# EasyEDA Pro project powerbank.epro

# Schematic Schematic1
Board Name: Board1; Create Date: 2026-05-27; Page Name: P1; Project Name: PowerbankForConsole7; Schematic Name: Schematic1; Update Date: 2026-05-28; Company: EasyEDA.com; Page Size: A4; Version: V1.0
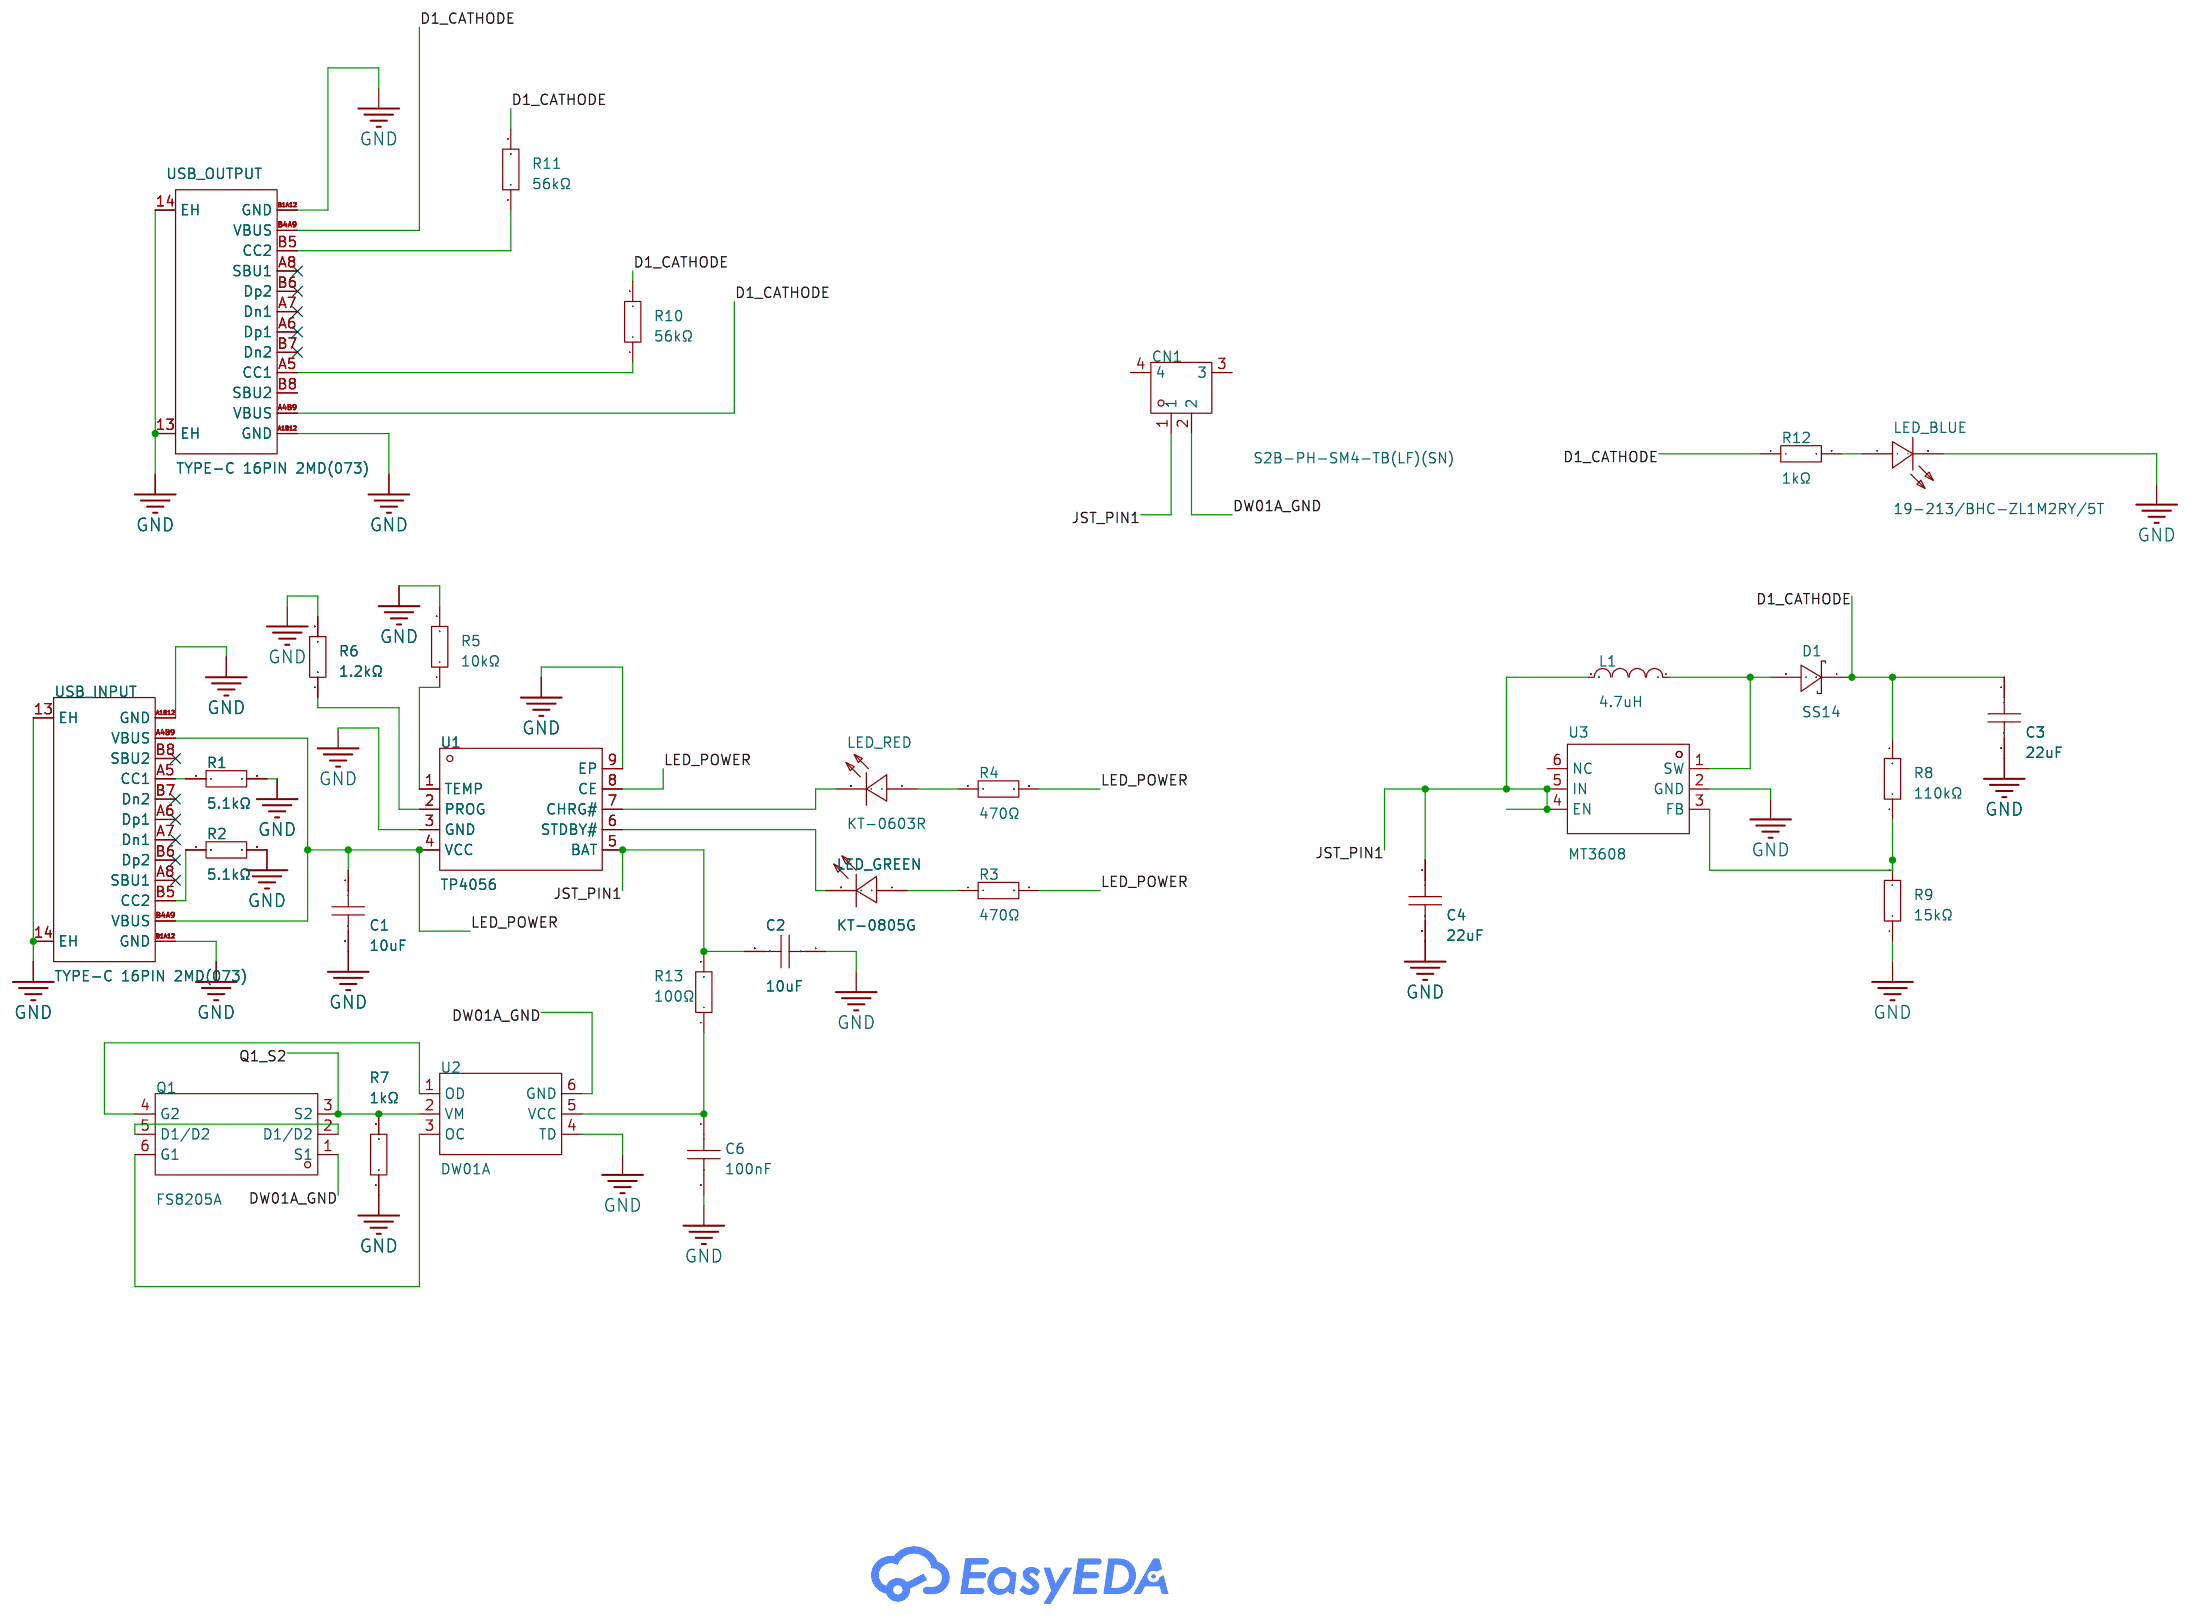
[diagram p0: schematic sheet]

## Parts
C1  10uF  [C0201]
C2  10uF  [C0201]
C3  22uF  [C0201]
C4  22uF  [C0201]
C6  100nF  [C0201]
CN1  S2B-PH-SM4-TB(LF)(SN)  [CONN-SMD_P2.00_S2B-PH-SM4-TB-LF-SN]
D1  SS14  [SMA_L4.2-W2.6-LS5.3-RD]
L1  4.7uH  [IND-SMD_L4.4-W4.2]
LED_BLUE  19-213/BHC-ZL1M2RY/5T  [LED0603-R-RD_BLUE]
LED_GREEN  KT-0805G  [LED0805-R-RD]
LED_RED  KT-0603R  [LED-SMD_L1.6-W0.8-R-RD]
Q1  FS8205A  [SOT-23-6_L2.9-W1.6-P0.95-LS2.8-BR]
R1  5.1kΩ  [R0603]
R2  5.1kΩ  [R0603]
R3  470Ω  [R0603]
R4  470Ω  [R0603]
R5  10kΩ  [R0603]
R6  1.2kΩ  [R0603]
R7  1kΩ  [R0603]
R8  110kΩ  [R0603]
R9  15kΩ  [R0603]
R10  56kΩ  [R0603]
R11  56kΩ  [R0603]
R12  1kΩ  [R0603]
R13  100Ω  [R0603]
U1  TP4056  [ESOP-8_L4.9-W3.9-P1.27-LS6.0-BL-EP]
U2  DW01A  [SOT-23-6_L2.9-W1.6-P0.95-LS2.8-BL]
U3  MT3608  [SOT-23-6_L2.9-W1.6-P0.95-LS2.8-BL]
USB_INPUT  TYPE-C 16PIN 2MD(073)  [USB-C-SMD_TYPE-C-16PIN-2MD-073]
USB_OUTPUT  TYPE-C 16PIN 2MD(073)  [USB-C-SMD_TYPE-C-16PIN-2MD-073]

## Library data of the parts
C1 C2 = CL10A106KP8NNNC: Capacitance:10uF Tolerance:±10% Tolerance:±10% Voltage Rating:10V Temperature Coefficient:X5R; LCSC Part Name: 10uF ±10% 10V; Supplier Part: C19702; Manufacturer: SAMSUNG(三星); Supplier Footprint: 0603; JLCPCB Part Class: Basic Part; Datasheet: https://item.szlcsc.com/datasheet/CL10A106KP8NNNC/20411.html; Supplier: LCSC; Tolerance: ±10%; Voltage Rating: 10V; Temperature Coefficient: X5R
C3 C4 = CL10A226MP8NUNE: Capacitance:22uF Tolerance:±20% Tolerance:±20% Voltage Rating:10V Temperature Coefficient:X5R; LCSC Part Name: 22uF ±20% 10V; Supplier Part: C86295; Manufacturer: SAMSUNG(三星); Supplier Footprint: 0603; JLCPCB Part Class: Extended Part; Datasheet: https://item.szlcsc.com/datasheet/CL10A226MP8NUNE/87471.html; Supplier: LCSC; Tolerance: ±20%; Voltage Rating: 10V; Temperature Coefficient: X5R
C6 = CL03A104KQ3NNNC: Capacitance:100nF Tolerance:±10% Tolerance:±10% Voltage Rating:6.3V Temperature Coefficient:X5R; LCSC Part Name: 100nF ±10% 6.3V; Supplier Part: C160831; Manufacturer: SAMSUNG(三星); Supplier Footprint: 0201; JLCPCB Part Class: Extended Part; Datasheet: https://item.szlcsc.com/datasheet/CL03A104KQ3NNNC/172212.html; Supplier: LCSC; Tolerance: ±10%; Voltage Rating: 6.3V; Temperature Coefficient: X5R
CN1 = S2B-PH-SM4-TB(LF)(SN): Pins Structure:1x2P Pitch:2mm Mounting Style:Horizontal attachment Reference Series:PH Number of Pins:2P Number of Rows:1 Number of PINs Per Row:2 Row Spacing:- Current Rating (Max):2A Contact Material:Copper alloy Contact Plating:Tin Operating Temperatur; LCSC Part Name: 1x2P 间距:2mm 卧贴 系列:PH; Supplier Part: C295747; Manufacturer: JST; Supplier Footprint: SMD,P=2mm,卧贴; JLCPCB Part Class: Extended Part; Datasheet: https://atta.szlcsc.com/upload/public/pdf/source/20210203/C295747_344B2E64535E381E727D98C302AB61C7.pdf; Supplier: LCSC; Pins Structure: 1x2P; Pitch: 2mm; Mounting Style: Horizontal attachment; Reference Series: PH; Number of Pins: 2P; Number of Rows: 1; Number of PINs Per Row: 2; Current Rating (Max): 2A; Contact Material: Copper alloy; Contact Plating: Tin; Operating Temperature Range: -25℃~+85℃; Rated Voltage (Max): 100V; Plastic Material: PA; Flame Retardant Rating: UL94V-0; Supplementary Features: Auxiliary soldering legs; Colour: Beige; Z-Height of the Board: 5.5mm; X-Length of Bottom Edge on Board (Spacing Line): 7.9mm; Y-Width of Bottom Edge on Board: 8.6mm
D1 = SS14_C7450452: Diode Configuration:Independent Voltage - Forward(Vf@If):550mV@1A Voltage - DC Reverse(Vr):40V Current - Rectified:1A Reverse Leakage Current (Ir):100uA@40V Operating Junction Temperature Range:-55℃~+150℃ Operating Junction Temperature Range:-55℃~+150℃ No; LCSC Part Name: 电压:40V 电流:1A; Supplier Part: C7450452; Manufacturer: LJ(朗捷); Supplier Footprint: DO-214AC(SMA); JLCPCB Part Class: Extended Part; Datasheet: https://item.szlcsc.com/datasheet/SS14/8475144.html; Supplier: LCSC; Diode Configuration: Independent; Voltage - Forward(Vf@If): 550mV@1A; Voltage - DC Reverse(Vr): 40V; Current - Rectified: 1A; Reverse Leakage Current (Ir): 100uA@40V; Operating Junction Temperature Range: -55℃~+150℃; Non-Repetitive Peak Forward Surge Current: 30A
L1 = FXL0420-4R7-M: Inductance:4.7uH Tolerance:±20% Tolerance:±20% Current Rating:2.8A Current - Saturation(Isat):3A DC Resistance(DCR):105mΩ Type:Molded Inductor; LCSC Part Name: 4.7uH ±20% 3A; Supplier Part: C167208; Manufacturer: cjiang(长江微电); Supplier Footprint: SMD,4.4x4.2mm; JLCPCB Part Class: Extended Part; Datasheet: https://item.szlcsc.com/datasheet/FXL0420-4R7-M/178591.html; Supplier: LCSC; Tolerance: ±20%; Current Rating: 2.8A; Current - Saturation(Isat): 3A; DC Resistance(DCR): 105mΩ; Type: Molded Inductor
LED_BLUE = 19-213/BHC-ZL1M2RY/5T: Lamp Holder Type:- Illumination Color:Blue Voltage - Forward(Vf):2.5V~3.1V Voltage - Forward(Vf):2.5V~3.1V Power(Watts):- Forward Current:- Wavelength - Dominant:465nm~475nm Wavelength - Dominant:465nm~475nm Peak Wavelength:468nm Diode Configuration:- Len; LCSC Part Name: 蓝色; Supplier Part: C2987539; Manufacturer: EVERLIGHT(亿光); Supplier Footprint: 0603; JLCPCB Part Class: Extended Part; Supplier: LCSC; Illumination Color: Blue; Voltage - Forward(Vf): 2.5V~3.1V; Wavelength - Dominant: 465nm~475nm; Peak Wavelength: 468nm; Lens Color: Water Clear; Luminous Intensity: 11.5mcd~28.5mcd; Viewing Angle: 120°; Operating Temperature: -40℃~+85℃
LED_GREEN = KT-0805G: Lamp Holder Type:2mm x 1.25mm square LED Illumination Color:Emerald Green Voltage - Forward(Vf):2.6V~3.1V Voltage - Forward(Vf):2.6V~3.1V Power(Watts):100mW Forward Current:5mA Wavelength - Dominant:513nm~528nm Wavelength - Dominant:513nm~528nm Peak Wavel; LCSC Part Name: 0805 翠绿 高亮; Supplier Part: C2297; Manufacturer: KENTO; Supplier Footprint: 0805; JLCPCB Part Class: Basic Part; Datasheet: https://item.szlcsc.com/datasheet/KT-0805G/2670.html; Supplier: LCSC; Lamp Holder Type: 2mm x 1.25mm square LED; Illumination Color: Emerald Green; Voltage - Forward(Vf): 2.6V~3.1V; Power(Watts): 100mW; Forward Current: 5mA; Wavelength - Dominant: 513nm~528nm; Peak Wavelength: 525nm; Diode Configuration: Discrete Diode; Lens Color: Water Clear; Luminous Intensity: 430mcd; Viewing Angle: 120°; Operating Temperature: -40℃~+85℃
LED_RED = KT-0603R: Lamp Holder Type:1.6mm x 0.8mm square LED Illumination Color:Red Voltage - Forward(Vf):1.8V~2.4V Voltage - Forward(Vf):1.8V~2.4V Power(Watts):40mW Forward Current:20mA Wavelength - Dominant:615nm~630nm Wavelength - Dominant:615nm~630nm Peak Wavelength:645; LCSC Part Name: 0603 红灯 高亮; Supplier Part: C2286; Manufacturer: KENTO; Supplier Footprint: 0603; JLCPCB Part Class: Basic Part; Datasheet: https://item.szlcsc.com/datasheet/KT-0603R/2659.html; Supplier: LCSC; Lamp Holder Type: 1.6mm x 0.8mm square LED; Illumination Color: Red; Voltage - Forward(Vf): 1.8V~2.4V; Power(Watts): 40mW; Forward Current: 20mA; Wavelength - Dominant: 615nm~630nm; Peak Wavelength: 645nm; Diode Configuration: Discrete Diode; Lens Color: Water Clear; Luminous Intensity: 300mcd; Viewing Angle: 120°; Operating Temperature: -40℃~+85℃
Q1 = FS8205A_C2830320: Type:2 N-Channel Drain Source Voltage (Vdss): Continuous Drain Current (Id): Drain Source On Resistance (RDS(on)@Vgs,Id):25mΩ@2.5V,3A Power Dissipation (Pd): Gate Threshold Voltage (Vgs(th)@Id):500mV@250uA Total Gate Charge (Qg@Vgs):5.7nC@10V Input Capaci; LCSC Part Name: 2个N沟道 耐压:20V 电流:6A; Supplier Part: C2830320; Manufacturer: TECH PUBLIC(台舟); Supplier Footprint: SOT-23-6; JLCPCB Part Class: Extended Part; Datasheet: https://atta.szlcsc.com/upload/public/pdf/source/20210810/F53B6D4E8755A1F8E11BAF814CE98E6A.pdf; Supplier: LCSC; Type: 2 N-Channel; Drain Source On Resistance (RDS(on)@Vgs,Id): 25mΩ@2.5V,3A; Gate Threshold Voltage (Vgs(th)@Id): 500mV@250uA; Total Gate Charge (Qg@Vgs): 5.7nC@10V; Input Capacitance (Ciss@Vds): 466pF@10V; Reverse Transfer Capacitance (Crss@Vds): 58pF@10V; Operating Temperature: -55℃~+150℃
R1 R2 = 0603WAF5101T5E: Type:Thick Film Resistor Resistance:5.1kΩ Tolerance:±1% Tolerance:±1% Power(Watts):100mW Voltage-Supply(Max):75V Temperature Coefficient:±100ppm/℃ Temperature Coefficient:±100ppm/℃ Operating Temperature:-55℃~+155℃ Operating Temperature:-55℃~+155℃; LCSC Part Name: 5.1kΩ ±1% 100mW 厚膜电阻; Supplier Part: C23186; Manufacturer: UNI-ROYAL(厚声); Supplier Footprint: 0603; JLCPCB Part Class: Basic Part; Datasheet: https://item.szlcsc.com/datasheet/0603WAF5101T5E/23913.html; Supplier: LCSC; Type: Thick Film Resistor; Tolerance: ±1%; Power(Watts): 100mW; Voltage-Supply(Max): 75V; Temperature Coefficient: ±100ppm/℃; Operating Temperature: -55℃~+155℃
R3 R4 = 0603WAF4700T5E: Type:Thick Film Resistor Resistance:470Ω Tolerance:±1% Tolerance:±1% Power(Watts):100mW Voltage-Supply(Max):75V Temperature Coefficient:±100ppm/℃ Temperature Coefficient:±100ppm/℃ Operating Temperature:-55℃~+155℃ Operating Temperature:-55℃~+155℃; LCSC Part Name: 470Ω ±1% 100mW 厚膜电阻; Supplier Part: C23179; Manufacturer: UNI-ROYAL(厚声); Supplier Footprint: 0603; JLCPCB Part Class: Basic Part; Datasheet: https://item.szlcsc.com/datasheet/0603WAF4700T5E/23906.html; Supplier: LCSC; Type: Thick Film Resistor; Tolerance: ±1%; Power(Watts): 100mW; Voltage-Supply(Max): 75V; Temperature Coefficient: ±100ppm/℃; Operating Temperature: -55℃~+155℃
R5 = 0603WAF1002T5E: Type:Thick Film Resistor Resistance:10kΩ Tolerance:±1% Tolerance:±1% Power(Watts):100mW Voltage-Supply(Max):75V Temperature Coefficient:±100ppm/℃ Temperature Coefficient:±100ppm/℃ Operating Temperature:-55℃~+155℃ Operating Temperature:-55℃~+155℃; LCSC Part Name: 厚膜电阻 10kΩ ±1% 100mW; Supplier Part: C25804; Manufacturer: UNI-ROYAL(厚声); Supplier Footprint: 0603; JLCPCB Part Class: Basic Part; Datasheet: https://item.szlcsc.com/datasheet/0603WAF1002T5E/26547.html; Supplier: LCSC; Type: Thick Film Resistor; Tolerance: ±1%; Power(Watts): 100mW; Voltage-Supply(Max): 75V; Temperature Coefficient: ±100ppm/℃; Operating Temperature: -55℃~+155℃
R6 = RC0603FR-071K2L: Type:Thick Film Resistor Resistance:1.2kΩ Tolerance:±1% Tolerance:±1% Power(Watts):100mW Voltage-Supply(Max):75V Temperature Coefficient:±100ppm/℃ Temperature Coefficient:±100ppm/℃ Operating Temperature:-55℃~+155℃ Operating Temperature:-55℃~+155℃; LCSC Part Name: 厚膜电阻 1.2kΩ ±1% 100mW; Supplier Part: C114605; Manufacturer: YAGEO(国巨); Supplier Footprint: 0603; JLCPCB Part Class: Extended Part; Datasheet: https://item.szlcsc.com/datasheet/RC0603FR-071K2L/115849.html; Supplier: LCSC; Type: Thick Film Resistor; Tolerance: ±1%; Power(Watts): 100mW; Voltage-Supply(Max): 75V; Temperature Coefficient: ±100ppm/℃; Operating Temperature: -55℃~+155℃
R7 R12 = RC0603FR-071KL: Type:Thick Film Resistor Resistance:1kΩ Tolerance:±1% Tolerance:±1% Power(Watts):100mW Voltage-Supply(Max):75V Temperature Coefficient:±100ppm/℃ Temperature Coefficient:±100ppm/℃ Operating Temperature:-55℃~+155℃ Operating Temperature:-55℃~+155℃; LCSC Part Name: 厚膜电阻 1kΩ ±1% 100mW; Supplier Part: C22548; Manufacturer: YAGEO(国巨); Supplier Footprint: 0603; JLCPCB Part Class: Extended Part; Datasheet: https://item.szlcsc.com/datasheet/RC0603FR-071KL/23274.html; Supplier: LCSC; Type: Thick Film Resistor; Tolerance: ±1%; Power(Watts): 100mW; Voltage-Supply(Max): 75V; Temperature Coefficient: ±100ppm/℃; Operating Temperature: -55℃~+155℃
R8 = 0603WAF1103T5E: Type:Thick Film Resistor Resistance:110kΩ Tolerance:±1% Tolerance:±1% Power(Watts):100mW Voltage-Supply(Max):75V Temperature Coefficient:±100ppm/℃ Temperature Coefficient:±100ppm/℃ Operating Temperature:-55℃~+155℃ Operating Temperature:-55℃~+155℃; LCSC Part Name: 110kΩ ±1% 100mW 厚膜电阻; Supplier Part: C25805; Manufacturer: UNI-ROYAL(厚声); Supplier Footprint: 0603; JLCPCB Part Class: Extended Part; Datasheet: https://item.szlcsc.com/datasheet/0603WAF1103T5E/26548.html; Supplier: LCSC; Type: Thick Film Resistor; Tolerance: ±1%; Power(Watts): 100mW; Voltage-Supply(Max): 75V; Temperature Coefficient: ±100ppm/℃; Operating Temperature: -55℃~+155℃
R9 = RC0603FR-0715KL: Type:Thick Film Resistor Resistance:15kΩ Tolerance:±1% Tolerance:±1% Power(Watts):100mW Voltage-Supply(Max):75V Temperature Coefficient:±100ppm/℃ Temperature Coefficient:±100ppm/℃ Operating Temperature:-55℃~+155℃ Operating Temperature:-55℃~+155℃; LCSC Part Name: 厚膜电阻 15kΩ ±1% 100mW; Supplier Part: C114661; Manufacturer: YAGEO(国巨); Supplier Footprint: 0603; JLCPCB Part Class: Extended Part; Datasheet: https://item.szlcsc.com/datasheet/RC0603FR-0715KL/115905.html; Supplier: LCSC; Type: Thick Film Resistor; Tolerance: ±1%; Power(Watts): 100mW; Voltage-Supply(Max): 75V; Temperature Coefficient: ±100ppm/℃; Operating Temperature: -55℃~+155℃
R10 R11 = 0603WAF5602T5E: Type:Thick Film Resistor Resistance:56kΩ Tolerance:±1% Tolerance:±1% Power(Watts):100mW Voltage-Supply(Max):75V Temperature Coefficient:±100ppm/℃ Temperature Coefficient:±100ppm/℃ Operating Temperature:-55℃~+155℃ Operating Temperature:-55℃~+155℃; LCSC Part Name: 56kΩ ±1% 100mW 厚膜电阻; Supplier Part: C23206; Manufacturer: UNI-ROYAL(厚声); Supplier Footprint: 0603; JLCPCB Part Class: Basic Part; Datasheet: https://item.szlcsc.com/datasheet/0603WAF5602T5E/23933.html; Supplier: LCSC; Type: Thick Film Resistor; Tolerance: ±1%; Power(Watts): 100mW; Voltage-Supply(Max): 75V; Temperature Coefficient: ±100ppm/℃; Operating Temperature: -55℃~+155℃
R13 = RC0603FR-07100RL: Type:Thick Film Resistors Resistance: Tolerance:±1% Tolerance:±1% Power(Watts): Overload Voltage (Max): Temperature Coefficient:±100ppm/℃ Temperature Coefficient:±100ppm/℃ Operating Temperature Range:-55℃~+155℃ Operating Temperature Range:-55℃~+155℃; LCSC Part Name: 厚膜电阻 100Ω ±1% 100mW; Supplier Part: C105588; Manufacturer: YAGEO(国巨); Supplier Footprint: 0603; JLCPCB Part Class: Extended Part; Datasheet: https://atta.szlcsc.com/upload/public/pdf/source/20180316/70C0E2BDAE7FCC62C531A5A58D202EE1.pdf; Supplier: LCSC; Type: Thick Film Resistors; Tolerance: ±1%; Temperature Coefficient: ±100ppm/℃; Operating Temperature Range: -55℃~+155℃
U1 = TP4056_C382139: The Chip Type:Charging IC Voltage - Supply:4V~6V Voltage - Supply:4V~6V Charge Current - Max:1A Charging Saturation Voltage:4.2V End-Off Voltage:- Type of Battery:Lithium Battery Number of Cells:1 Number of Cells:1 Operating Temperature:-40℃~+85℃ Operatin; LCSC Part Name: 1A锂电池充电IC; Supplier Part: C382139; Manufacturer: TPOWER(天源); Supplier Footprint: ESOP-8; JLCPCB Part Class: Extended Part; Datasheet: https://item.szlcsc.com/datasheet/TP4056/354934.html; Supplier: LCSC; The Chip Type: Charging IC; Voltage - Supply: 4V~6V; Charge Current - Max: 1A; Charging Saturation Voltage: 4.2V; Type of Battery: Lithium Battery; Number of Cells: 1; Operating Temperature: -40℃~+85℃; Battery Temperature Detection: Support; Supply Current (Iq): 1uA; Features: Constant voltage charging；Constant current charging；Automatic recharge；Charge termination；Soft start；Programmable charging current；Undervoltage lockout；Trickle charging
U2 = DW01A_C351410: The Chip Type:Protection IC Voltage - Supply:300mV~10V Voltage - Supply:300mV~10V Charge Current - Max:- Charging Saturation Voltage:4.3V End-Off Voltage:2.5V Type of Battery:Lithium Battery Number of Cells:1 Number of Cells:1 Operating Temperature:-40℃~+; LCSC Part Name: 单节锂离子/锂聚合物电池保护IC; Supplier Part: C351410; Manufacturer: PUOLOP(迪浦); Supplier Footprint: SOT-23-6L; JLCPCB Part Class: Extended Part; Datasheet: https://item.szlcsc.com/datasheet/DW01A/327628.html; Supplier: LCSC; The Chip Type: Protection IC; Voltage - Supply: 300mV~10V; Charging Saturation Voltage: 4.3V; End-Off Voltage: 2.5V; Type of Battery: Lithium Battery; Number of Cells: 1; Operating Temperature: -40℃~+85℃; Battery Temperature Detection: Not supported; 0V Battery Charge: Support; Supply Current (Iq): 3uA; Features: Overcurrent Protection；Overcharge protection；Over-discharge protection；Short-Circuit  Protection
U3 = MT3608: Function:Boost Output Type:Adjustable Voltage - Supply:2V~24V Voltage - Supply:2V~24V Output Voltage:- Output Voltage:- Output Current:2A Frequency - Switching:1.2MHz Frequency - Switching:1.2MHz Operating Temperature:-40℃~+85℃ Operating Temperature:-40℃~; LCSC Part Name: 老版本 高效1.2MHz 2A升压转换器; Supplier Part: C84817; Manufacturer: 西安航天民芯; Supplier Footprint: SOT-23-6; JLCPCB Part Class: Extended Part; Datasheet: https://item.szlcsc.com/datasheet/MT3608/85988.html; Supplier: LCSC; Function: Boost; Output Type: Adjustable; Voltage - Supply: 2V~24V; Output Current: 2A; Frequency - Switching: 1.2MHz; Operating Temperature: -40℃~+85℃; Synchronous Rectifier: No; Number of Outputs: 1; Topology: Boost; Quiescent Current: 100uA；1.6mA; Switch tube (built-in/external): Built-in
USB_INPUT USB_OUTPUT = TYPE-C 16PIN 2MD(073): Connector Type:Type-C Protocol Standard:- Gender:Female Mounting Type:Surface Mount, Right Angle Number of Contacts:16P Number of Ports:1 Current Rating-Power:3A Voltage Rating:5V Connect-Disconnect Life:10,000 Cycles Supplementary Features:- Center Heigh; LCSC Part Name: Type-C 母 卧贴; Supplier Part: C2765186; Manufacturer: SHOU HAN(首韩); Supplier Footprint: SMD; JLCPCB Part Class: Extended Part; Datasheet: https://item.szlcsc.com/datasheet/TYPE-C%252016PIN%25202MD(073)/2901843.html; Supplier: LCSC; Connector Type: Type-C; Gender: Female; Mounting Type: Surface Mount, Right Angle; Number of Contacts: 16P; Number of Ports: 1; Current Rating-Power: 3A; Voltage Rating: 5V; Connect-Disconnect Life: 10,000 Cycles; Detection color: Black; Operating Temperature: -25℃~+85℃

## Nets
GND: C1.2 C2.1 C3.2 C4.2 C6.2 LED_BLUE.2(-) R1.2 R2.2 R5.2 R6.2 R7.1 R9.1 U1.3(GND) U1.9(EP) U2.4(TD) U3.2(GND) USB_INPUT.13(EH) USB_INPUT.14(EH) USB_INPUT.A1B12(GND) USB_INPUT.B1A12(GND) USB_OUTPUT.13(EH) USB_OUTPUT.14(EH) USB_OUTPUT.A1B12(GND) USB_OUTPUT.B1A12(GND)
D1_CATHODE: C3.1 D1.1(C) R8.2 R10.2 R11.2 R12.1 USB_OUTPUT.A4B9(VBUS) USB_OUTPUT.B4A9(VBUS)
DW01A_GND: CN1.2 Q1.1(S1) U2.6(GND)
JST_PIN1: C2.2 C4.1 CN1.1 L1.2 R13.2 U1.5(BAT) U3.4(EN) U3.5(IN)
LED_POWER: C1.1 R3.2 R4.2 U1.4(VCC) U1.8(CE) USB_INPUT.A4B9(VBUS) USB_INPUT.B4A9(VBUS)
Q1_S2: Q1.3(S2) R7.2 U2.2(VM)
$1N2121: R1.1 USB_INPUT.A5(CC1)
$1N2367: R2.1 USB_INPUT.B5(CC2)
$1N2585: LED_RED.2(K) U1.7(CHRG#)
$1N2914: Q1.6(G1) U2.3(OC)
$1N3363: R5.1 U1.1(TEMP)
$1N3368: R6.1 U1.2(PROG)
$1N3622: Q1.4(G2) U2.1(OD)
$1N4180: Q1.2(D1/D2) Q1.5(D1/D2)
$1N4307: D1.2(A) L1.1 U3.1(SW)
$1N6037: R10.1 USB_OUTPUT.A5(CC1)
$1N6042: R11.1 USB_OUTPUT.B5(CC2)
$1N6465: LED_BLUE.1(+) R12.2
$1N7422: LED_GREEN.2(K) U1.6(STDBY#)
$1N8287: R8.1 R9.2 U3.3(FB)
$1N8557: C6.1 R13.1 U2.5(VCC)
$1N8587: LED_GREEN.1(A) R3.1
$1N8590: LED_RED.1(A) R4.1

Not connected (* = marked no-connect by the designer): CN1 3 4; U3 6(NC); USB_INPUT A6(Dp1)* A7(Dn1)* A8(SBU1)* B6(Dp2)* B7(Dn2)* B8(SBU2)*; USB_OUTPUT A6(Dp1)* A7(Dn1)* A8(SBU1)* B6(Dp2)* B7(Dn2)* B8(SBU2)

# Board PCB1
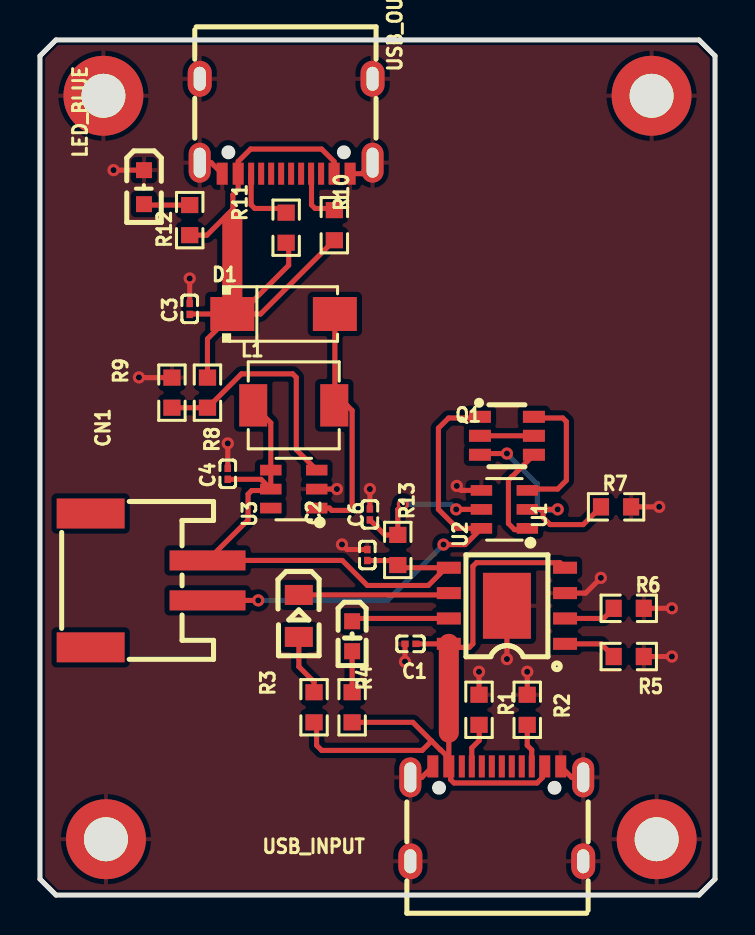
[diagram p1: board, top side]
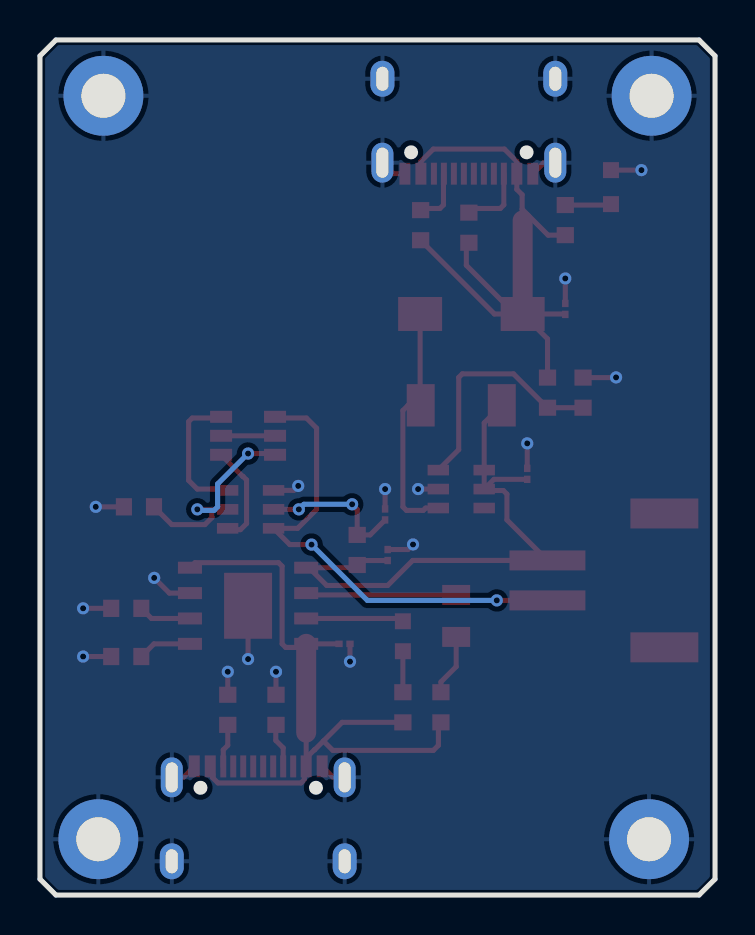
[diagram p2: board, bottom side, seen from below]

Outline 33.78 x 42.8 mm; copper layers: Top Layer, Bottom Layer. Coordinates in mm from the lower left corner of the outline.
Outline path: 0,42 0,0.8 0.8,0 32.98,0 33.78,0.8 33.78,42 32.98,42.8 0.8,42.8 0,42
Stack: Top Layer 0.035mm / Dielectric1 1.51mm FR4 er 4.5 / Bottom Layer 0.035mm

## Design rules (mm)
template: JLCPCB Capability(Two Layers Board)
spacing copperThickness1oz (default): track to track 0.102, other pairs 0.152 to 0.3
spacing copperThickness2oz: track to track 0.203, other pairs 0.152 to 0.3
track width copperThickness1oz (default): min 0.127, default 0.254, max 2.54
track width copperThickness2oz: min 0.203, default 0.254, max 2.54
differential pair differentialPair (default): width min 0.127, default 0.254, max 2.54; gap min 0.152, default 0.152
via viaSize (default): diameter min 0.5, default 0.61, max 10; hole min 0.3, default 0.305, max 6.3

## Placement (name value [footprint] x y rotation side)
C1  10uF  [C0201]  18.54 12.57 180 top
C2  10uF  [C0201]  16.38 17.02 270 top
C3  22uF  [C0201]  7.49 29.34 90 top
C4  22uF  [C0201]  9.4 21.08 90 top
C6  100nF  [C0201]  16.51 19.05 90 top
CN1  S2B-PH-SM4-TB(LF)(SN)  [CONN-SMD_P2.00_S2B-PH-SM4-TB-LF-SN]  5.46 15.75 270 top
D1  SS14  [SMA_L4.2-W2.6-LS5.3-RD]  12.19 29.08 0 top
L1  4.7uH  [IND-SMD_L4.4-W4.2]  12.7 24.51 0 top
LED_BLUE  19-213/BHC-ZL1M2RY/5T  [LED0603-R-RD_BLUE]  5.21 35.43 270 top
LED_GREEN  KT-0805G  [LED0805-R-RD]  12.95 13.97 270 top
LED_RED  KT-0603R  [LED-SMD_L1.6-W0.8-R-RD]  15.62 12.95 270 top
NOREF  -  [Pad_e1164]  30.61 40 0 top
NOREF#2  -  [Pad_e340]  3.18 40 0 top
NOREF#3  -  [Pad_e1712]  30.86 2.79 0 top
NOREF#4  -  [Pad_e1576]  3.3 2.79 0 top
Q1  FS8205A  [SOT-23-6_L2.9-W1.6-P0.95-LS2.8-BR]  23.37 22.99 180 top
R1  5.1kΩ  [R0603]  21.97 9.27 90 top
R2  5.1kΩ  [R0603]  24.38 9.27 90 top
R3  470Ω  [R0603]  13.72 9.4 270 top
R4  470Ω  [R0603]  15.62 9.4 270 top
R5  10kΩ  [R0603]  29.46 11.94 0 top
R6  1.2kΩ  [R0603]  29.46 14.35 0 top
R7  1kΩ  [R0603]  28.83 19.43 180 top
R8  110kΩ  [R0603]  8.38 25.15 90 top
R9  15kΩ  [R0603]  6.6 25.15 270 top
R10  56kΩ  [R0603]  14.73 33.53 270 top
R11  56kΩ  [R0603]  12.32 33.4 270 top
R12  1kΩ  [R0603]  7.49 33.78 90 top
R13  100Ω  [R0603]  17.91 17.27 270 top
U1  TP4056  [ESOP-8_L4.9-W3.9-P1.27-LS6.0-BL-EP]  23.37 14.48 90 top
U2  DW01A  [SOT-23-6_L2.9-W1.6-P0.95-LS2.8-BL]  23.24 19.3 90 top
U3  MT3608  [SOT-23-6_L2.9-W1.6-P0.95-LS2.8-BL]  12.7 20.32 90 top
USB_INPUT  TYPE-C 16PIN 2MD(073)  [USB-C-SMD_TYPE-C-16PIN-2MD-073]  22.86 4.06 0 top
USB_OUTPUT  TYPE-C 16PIN 2MD(073)  [USB-C-SMD_TYPE-C-16PIN-2MD-073]  12.32 38.48 180 top

## Footprints (pads in the part's own frame, mm; a bottom-side part is the same pattern mirrored in y, then rotated)
C0201
  rect 0.368x0.324 smd: 1(-0.275,0) 2(0.275,0)
CONN-SMD_P2.00_S2B-PH-SM4-TB-LF-SN
  rect 1x3.8 smd: 1(-1,2.925) 2(1,2.925)
  rect 1.5x3.4 smd: 3(3.35,-2.925) 4(-3.35,-2.925)
ESOP-8_L4.9-W3.9-P1.27-LS6.0-BL-EP
  rect 0.6x1.2 smd: 1(-1.905,-2.909) 2(-0.635,-2.909) 3(0.635,-2.909) 4(1.905,-2.909) 5(1.905,2.909) 6(0.635,2.909) 7(-0.635,2.909) 8(-1.905,2.909)
  rect 3.3x2.4 smd: 9(0,0)
IND-SMD_L4.4-W4.2
  rect 1.4x2.12 smd: 1(2.028,0) 2(-2.028,0)
LED0603-R-RD_BLUE
  rect 0.8x0.8 smd: 1(0.851,0) 2(-0.851,0)
LED0805-R-RD
  rect 1x1.399 smd: 1(1.05,0) 2(-1.05,0)
LED-SMD_L1.6-W0.8-R-RD
  rect 0.8x0.8 smd: 1(0.75,0) 2(-0.75,0)
Pad_e340
  round 4 hole 2.2: 2(0,0)
Pad_e1164
  round 4 hole 2.2: 2(0,0)
Pad_e1576
  round 4 hole 2.2: 2(0,0)
Pad_e1712
  round 4 hole 2.2: 2(0,0)
R0603
  rect 0.806x0.864 smd: 1(-0.753,0) 2(0.753,0)
SMA_L4.2-W2.6-LS5.3-RD
  rect 2.2x1.7 smd: 1(-2.566,0) 2(2.566,0)
SOT-23-6_L2.9-W1.6-P0.95-LS2.8-BL
  rect 0.532x1.072 smd: 1(-0.95,-1.149) 2(0,-1.149) 3(0.95,-1.149) 4(0.95,1.149) 5(0,1.149) 6(-0.95,1.149)
SOT-23-6_L2.9-W1.6-P0.95-LS2.8-BR
  rect 1.1x0.6 smd: 1(1.35,-0.95) 2(1.35,0) 3(1.35,0.95) 4(-1.35,0.95) 5(-1.35,0) 6(-1.35,-0.95)
USB-C-SMD_TYPE-C-16PIN-2MD-073
  oval 1.1x2 hole 0.6x1.5: 13(-4.325,1.825) 14(4.325,1.825)
  oval 1.2x1.8 hole 0.6x1.2: 13(-4.325,-2.375) 14(4.325,-2.375)
  rect 0.55x1.1 smd: A1B12(-3.2,2.375) A4B9(-2.4,2.375) B1A12(3.2,2.375) B4A9(2.4,2.375)
  rect 0.3x1.1 smd: A5(-1.25,2.375) A6(-0.25,2.375) A7(0.25,2.375) A8(1.25,2.375) B5(1.75,2.375) B6(0.75,2.375) B7(-0.75,2.375) B8(-1.75,2.375)

## Nets
As in the schematic, except:
GND: C1.2 C2.1 C3.2 C4.2 C6.2 LED_BLUE.2 NOREF.2 NOREF#2.2 NOREF#3.2 NOREF#4.2 R1.2 R2.2 R5.2 R6.2 R7.1 R9.1 U1.3 U1.9 U2.4 U3.2 USB_INPUT.13 USB_INPUT.14 USB_INPUT.A1B12 USB_INPUT.B1A12 USB_OUTPUT.13 USB_OUTPUT.14 USB_OUTPUT.A1B12 USB_OUTPUT.B1A12

Pads without a net: CN1 3 4; U3 6; USB_INPUT A6 A7 A8 B6 B7 B8; USB_OUTPUT A6 A7 A8 B6 B7 B8

## Via types
v1: diameter 0.61, hole 0.305, Top Layer to Bottom Layer, 22 vias

## Routing (per net, layer and track width the routed paths; a pad name or vN(x,y) marks a point on that pad's centre or on a via; arc(x,y) is an arc through that point)
GND: length 28
  Top Layer w0.254: v1(20.86,20.48) 21.08,20.25 U2.4 ; U1.9 v1(23.37,11.81) ; R1.2 v1(21.97,11.18) ; C3.2 v1(7.49,30.86) ; C2.1 15.37,17.29 v1(15.11,17.55) ; LED_BLUE.2 v1(3.68,36.28) ; USB_OUTPUT.A1B12 16.09,36.11 USB_OUTPUT.13 ; U3.2 v1(14.86,20.32) ; 18.53,5.89 19.11,5.89 USB_INPUT.A1B12 ; v1(28.07,15.88) 27.31,15.11 U1.3 ; R5.2 v1(31.62,11.94) ; R9.1 4.96,25.9 v1(4.95,25.91) ; USB_INPUT.14 26.61,5.89 USB_INPUT.B1A12 ; C6.2 v1(16.51,20.32) ; USB_OUTPUT.14 8.57,36.66 USB_OUTPUT.B1A12 ; R6.2 v1(31.62,14.35) ; C1.2 v1(18.27,11.68) ; R7.1 v1(30.99,19.43) ; C4.2 v1(9.4,22.61) ; R2.2 v1(24.38,11.18)
D1_CATHODE: length 33.6
  Top Layer w0.254: 9.65,34.33 9.65,34.04 ; 9.65,34.33 8.35,33.03 R12.1 ; 9.65,34.33 9.65,35.05 9.92,35.32 USB_OUTPUT.B4A9 9.92,36.72 10.54,37.34 14.1,37.34 14.72,36.72 USB_OUTPUT.A4B9 ; D1.1 11.04,29.08 R10.2 ; D1.1 7.51,29.08 C3.1 ; D1.1 8.38,27.84 R8.2 ; R11.2 12.45,32.52 12.45,31.52 10.03,29.11 9.65,29.11 ; 9.65,33.79 9.63,33.76
  Top Layer w1: 9.63,33.76 D1.1
DW01A_GND: length 24.1
  Top Layer w0.254: v1(20.19,17.54) 21.28,17.54 U2.6 20.89,18.35 19.94,19.3 19.94,23.37 20.45,23.88 21.58,23.88 21.64,23.94 Q1.1 ; CN1.2 v1(10.92,14.75)
  Bottom Layer w0.254: v1(20.19,17.54) 17.4,14.75 v1(10.92,14.75)
JST_PIN1: length 29.4
  Top Layer w0.254: 20.32,16.38 19.43,15.49 16.38,15.49 15.13,16.75 CN1.1 10.41,18.78 10.41,20.07 10.59,20.25 11.48,20.25 U3.5 ; 20.32,16.38 18.04,16.38 R13.2 17.68,16.74 C2.2 ; 20.32,16.38 U1.5 ; U3.5 11.06,20.81 C4.1 ; U3.5 U3.4 11.55,23.63 L1.2
LED_POWER: length 36.3
  Top Layer w0.254: 19.6,7.71 18.66,8.64 R4.2 ; 19.6,7.71 20.04,7.27 20.05,7.27 20.46,6.86 ; 19.6,7.71 19.12,7.24 14.1,7.24 13.84,7.49 13.84,8.52 R3.2 ; 20.46,6.86 20.46,8.13 ; 20.46,6.86 USB_INPUT.A4B9 20.46,6.31 20.55,6.22 20.55,5.77 20.72,5.61 24.88,5.61 25.15,5.88 25.15,6.03 25.13,6.03 ; C1.1 U1.8 20.64,12.39 21.49,12.39 21.66,12.57 21.66,16.46 21.84,16.64 26.02,16.64 U1.4
  Top Layer w1: U1.8 20.46,8.13
Q1_S2: length 11.1
  Top Layer w0.254: R7.2 27.19,18.54 25.53,18.54 25.18,18.89 25.18,19.3 ; v1(23.37,22.1) 22.08,22.1 Q1.3 ; U2.2 25.18,19.3 ; 25.18,19.3 v1(25.91,19.3)
  Bottom Layer w0.254: v1(23.37,22.1) 24.89,20.57 24.89,19.43 25.07,19.25 25.86,19.25 v1(25.91,19.3)
$1N2121: length 2.2
  Top Layer w0.254: USB_INPUT.A5 21.61,7.37 21.98,7.74 21.98,8.51 R1.1
$1N2367: length 2.2
  Top Layer w0.254: R2.1 24.38,7.49 24.61,7.27 USB_INPUT.B5
$1N2585: length 4.9
  Top Layer w0.254: U1.7 15.76,13.84 LED_RED.2
$1N2914: length 6.8
  Top Layer w0.254: Q1.6 24.78,23.88 26.16,23.88 26.34,23.7 26.34,20.75 25.91,20.32 24.46,20.32 U2.3
$1N3363: length 2.7
  Top Layer w0.254: U1.1 28.08,12.57 R5.1
$1N3368: length 2.6
  Top Layer w0.254: U1.2 28.2,13.84 R6.1
$1N3622: length 5.1
  Top Layer w0.254: Q1.4 23.64,20.95 23.62,20.95 23.44,20.78 23.44,18.59 23.75,18.29 24.32,18.29 U2.1
$1N4180: length 2.7
  Top Layer w0.254: Q1.5 Q1.2
$1N4307: length 12.3
  Top Layer w0.254: U3.1 14.48,19.37 14.6,19.25 15.44,19.25 15.62,19.43 15.62,24.25 15.36,24.51 L1.1 14.76,24.54 D1.2
$1N6037: length 2.8
  Top Layer w0.254: USB_OUTPUT.A5 13.59,36.09 13.59,34.54 13.77,34.36 14.65,34.36 R10.1
$1N6042: length 3.5
  Top Layer w0.254: USB_OUTPUT.B5 10.57,34.54 10.75,34.36 12.11,34.36 R11.1
$1N6465: length 2.3
  Top Layer w0.254: R12.2 5.25,34.54 LED_BLUE.1
$1N7422: length 7.5
  Top Layer w0.254: LED_GREEN.2 20.37,15.02 U1.6
$1N8287: length 12.1
  Top Layer w0.254: R9.2 R8.1 8.39,24.39 10.09,26.09 12.65,26.09 12.83,25.91 12.83,22.29 U3.3
$1N8557: length 7.4
  Top Layer w0.254: U2.5 v1(20.83,19.3) ; C6.1 17.26,18.03 R13.1 17.91,19.3 v1(18.16,19.56)
  Bottom Layer w0.254: v1(20.83,19.3) 20.57,19.56 v1(18.16,19.56)
$1N8587: length 3.1
  Top Layer w0.254: LED_GREEN.1 12.95,11.43 13.72,10.67 R3.1
$1N8590: length 2.1
  Top Layer w0.254: R4.1 LED_RED.1

## Copper pours and planes (outline as drawn; the poured copper is in the pictures)
GND on Top Layer: -3.94,46.36 35.81,46.36 35.81,-3.05 -3.94,-3.05
GND on Bottom Layer: -3.3,46.36 35.43,46.36 35.43,-3.94 -3.3,-3.94
